# EAGLE design gedge (EAGLE 6.5.0)
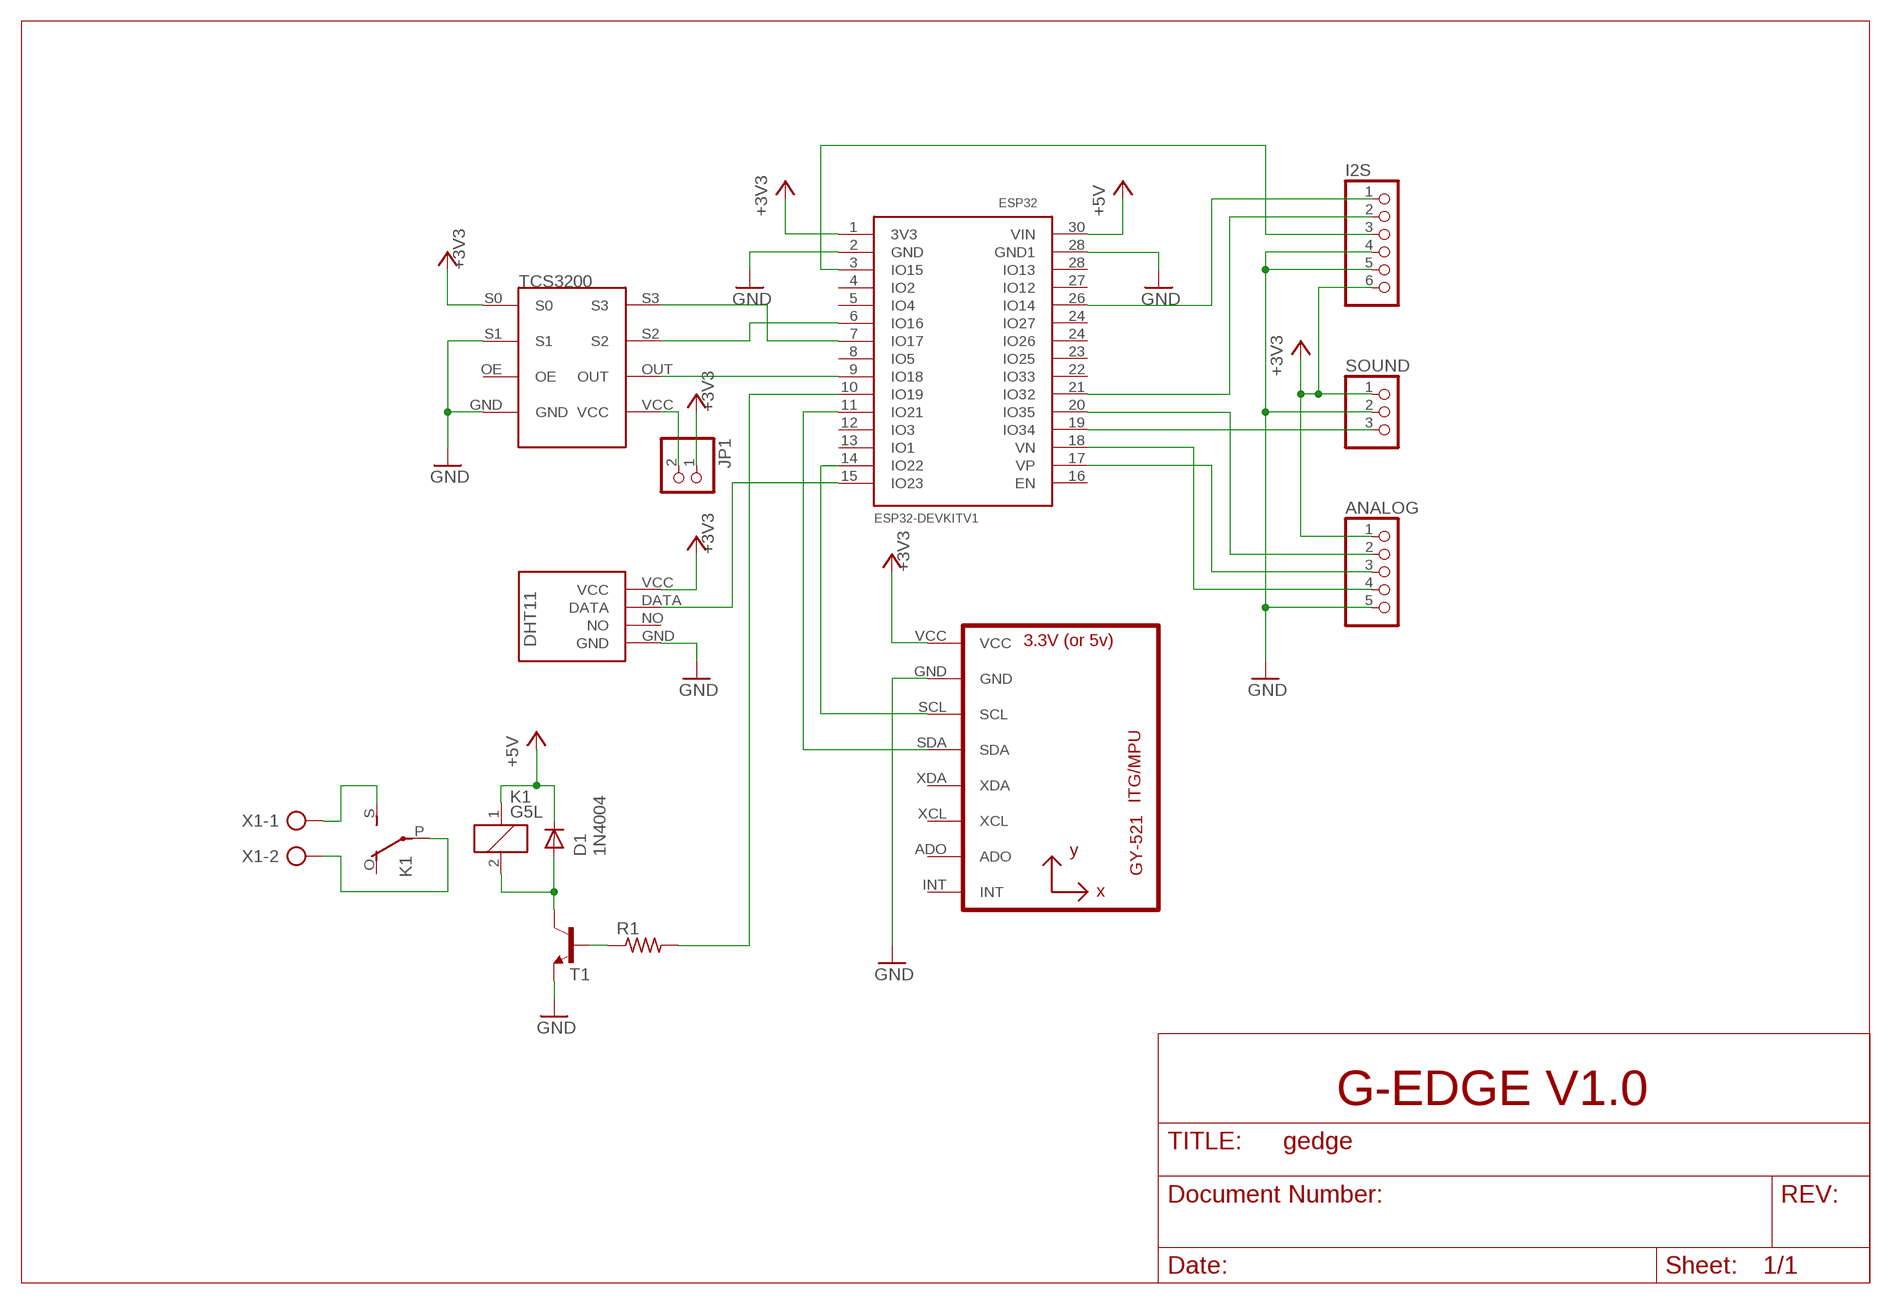
[diagram p0: schematic, sheet 1]

## Parts
ANALOG  PINHD-1X5  [1X05]
D1  1N4004  [DO41-10]
ESP32  ESP32DEVKITV1  [ESP32-DEVKITV1]
I2S  PINHD-1X6  [1X06]
JP1  PINHD-1X2  [1X02]
K1  G5L  [G5LE]
R1  R-US_0204/7  [0204/7]
SOUND  PINHD-1X3  [1X03]
T1  BC107A-NPN-TO18-EBC  [TO18]
TCS3200  TCS3200  [TCS3200]
U1  GY-521MPU6050  [GY-521]
U$2  DHT11  [DHT11]
X1  AK500/2  [AK500/2]

## Nets
+3V3: ANALOG.1 ESP32.1(3V3) I2S.6 JP1.1 SOUND.1 TCS3200.S0 U1.VCC U$2.VCC
+5V: D1.C ESP32.30(VIN) K1.1
GND: ANALOG.5 ESP32.2(GND) ESP32.28(GND1) I2S.4 I2S.5 SOUND.2 T1.1(E) TCS3200.GND TCS3200.S1 U1.GND U$2.GND
N$1: ESP32.6(IO16) TCS3200.S2
N$2: ESP32.7(IO17) TCS3200.S3
N$3: ESP32.19(IO34) SOUND.3
N$4: JP1.2 TCS3200.VCC
N$5: ESP32.9(IO18) TCS3200.OUT
N$6: ESP32.15(IO23) U$2.DATA
N$8: D1.A K1.2 T1.3(C)
N$9: K1.P(2:P) X1.2
N$10: K1.S(2:S) X1.1
N$11: R1.1 T1.2(B)
N$12: ESP32.10(IO19) R1.2
N$13: ESP32.14(IO22) U1.SCL
N$14: ESP32.11(IO21) U1.SDA
N$15: ANALOG.2 ESP32.20(IO35)
N$16: ANALOG.3 ESP32.17(VP)
N$17: ANALOG.4 ESP32.18(VN)
N$18: ESP32.3(IO15) I2S.3
N$19: ESP32.21(IO32) I2S.2
N$20: ESP32.26(IO14) I2S.1
Unconnected: ESP32.4(IO2) ESP32.5(IO4) ESP32.8(IO5) ESP32.12(IO3) ESP32.13(IO1) ESP32.16(EN) ESP32.22(IO33) ESP32.23(IO25) ESP32.24(IO26) ESP32.24(IO27) ESP32.27(IO12) ESP32.28(IO13) K1.O(2:O) TCS3200.OE U1.ADO U1.INT U1.XCL U1.XDA U$2.NO

## Notes on the sheet
- G-EDGE V1.0

## Library data of the parts
ANALOG = pinhead01:PINHD-1X5: PIN HEADER
D1 = diode:1N4004: DIODE general purpose rectifier, 1 A
ESP32 = ESP32-DEVKITV1:ESP32DEVKITV1
I2S = pinhead01:PINHD-1X6: PIN HEADER
JP1 = pinhead01:PINHD-1X2: PIN HEADER
K1 = relay:G5L: RELAY 1 x switch, 10 A/120 V AC, 8 A/30 V ADC, Omron; OC_FARNELL: unknown; OC_NEWARK: unknown
R1 = rcl:R-US_: RESISTOR, American symbol
SOUND = pinhead01:PINHD-1X3: PIN HEADER
T1 = transistor:*-NPN-: NPN Transistror BF959 corrected 2008.03.06
TCS3200 = TCS3200:TCS3200
U1 = gy-521:GY-521
U$2 = DHT11:DHT11: DHT11 Czujnik temperatury i wilgotności
X1 = con-ptr500:AK500/2: CONNECTOR; OC_FARNELL: unknown; OC_NEWARK: unknown

## Board
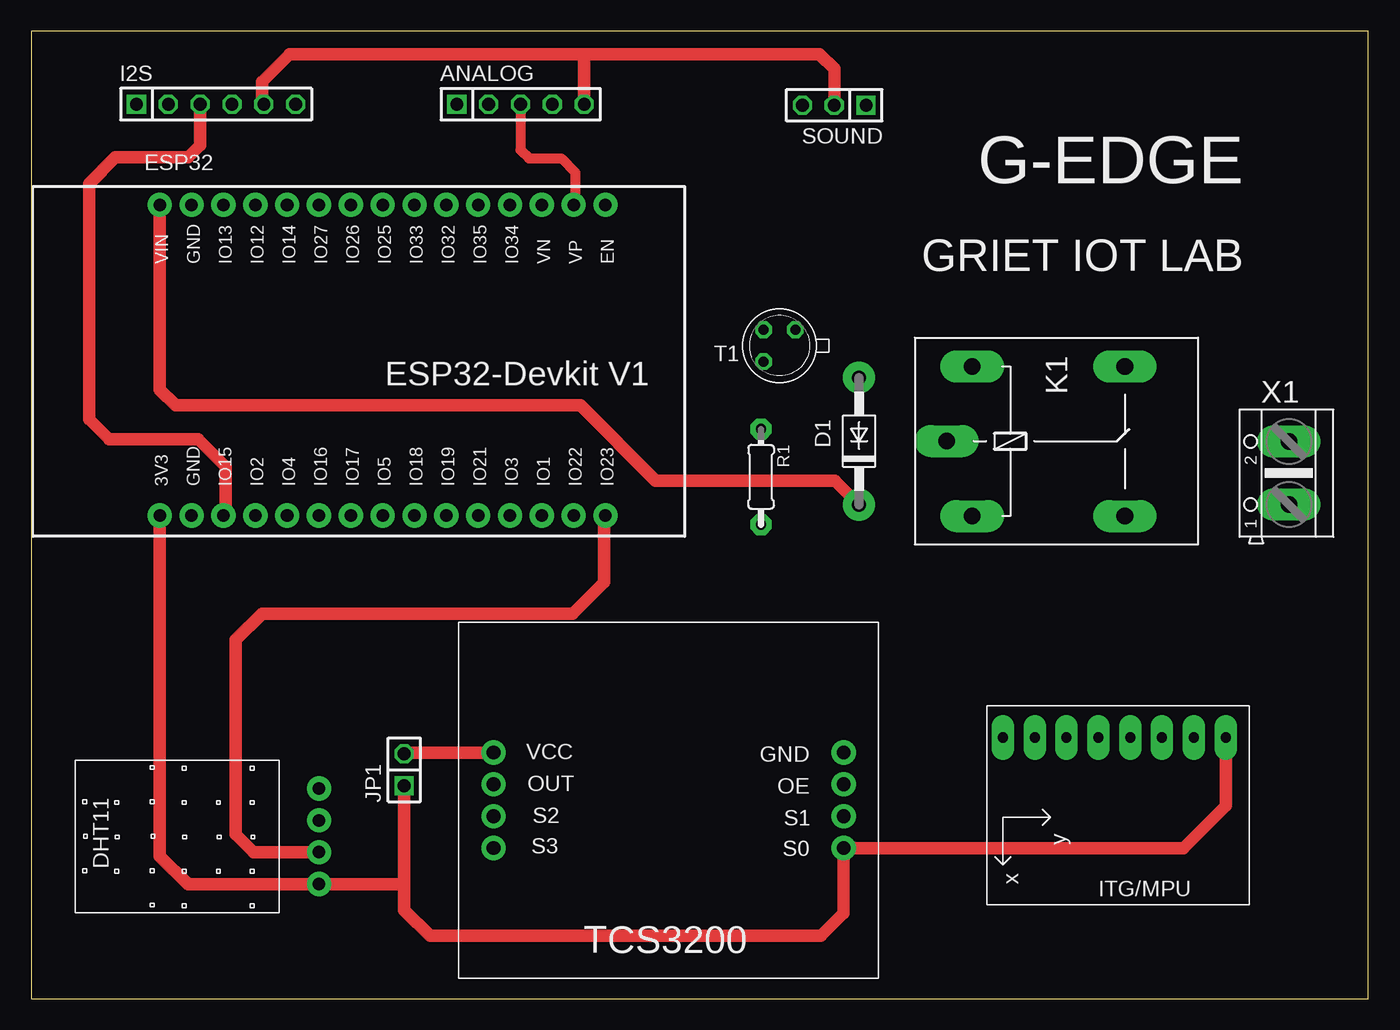
[diagram p1: board, top side]
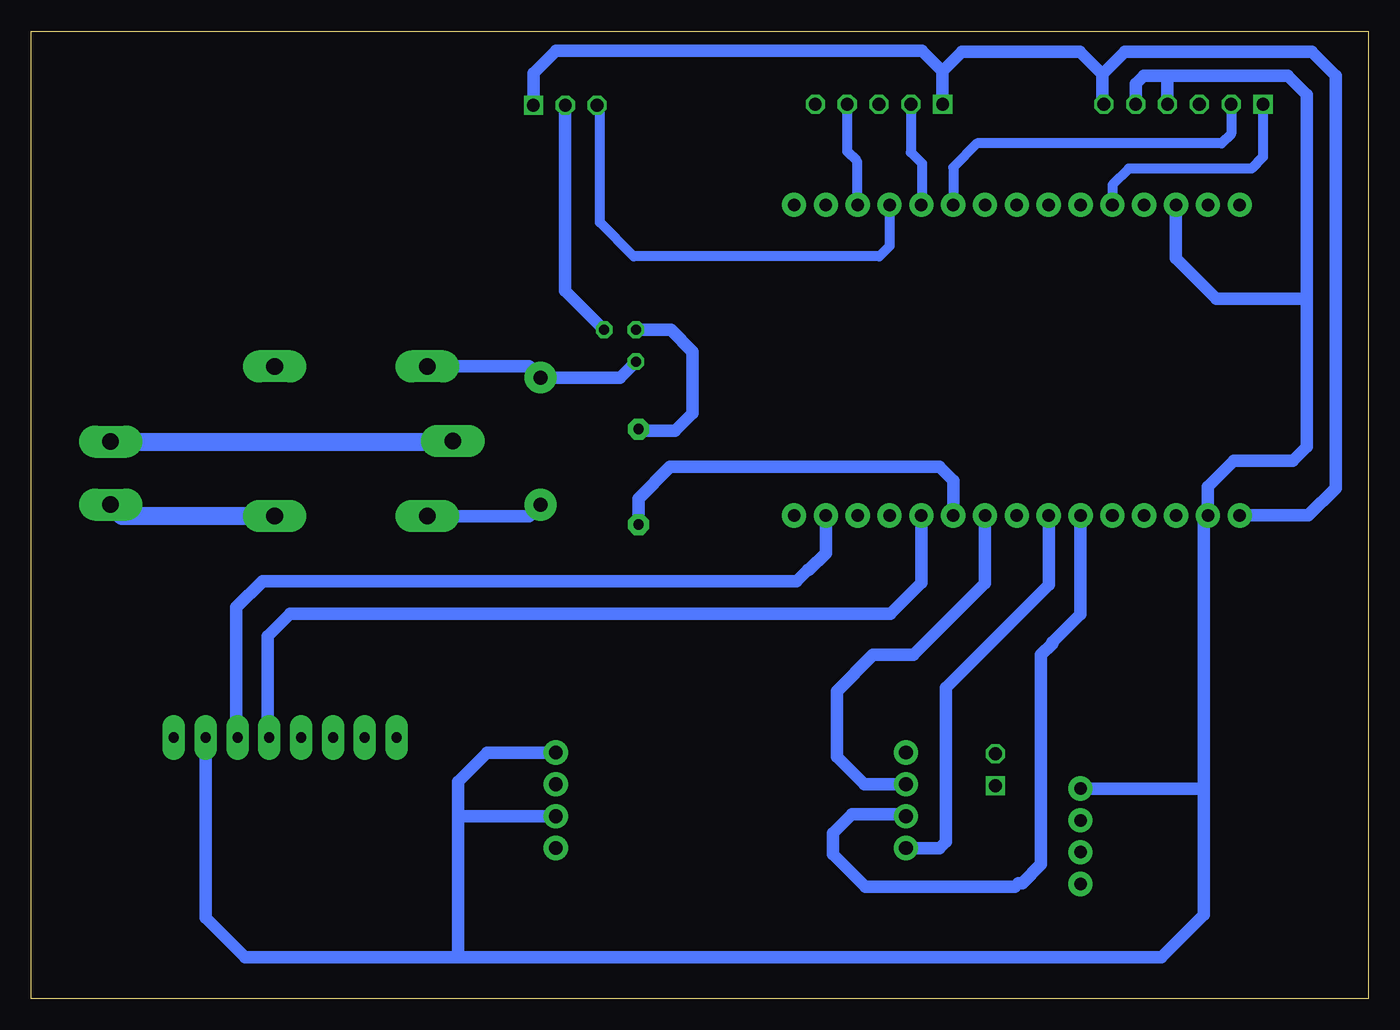
[diagram p2: board, bottom side, seen from below]

Size 106.66 x 77.14 mm. Coordinates in mm from the lower left corner, seen from the top.
Outline: 0,0 106.66,0 106.66,77.14 0,77.14 0,0
Copper layers (1*16): Top 0.035mm / dielectric 1.5mm / Bottom 0.035mm
Design rules "default": minimum track width 10mil, minimum drill 24mil, track to track 8mil, track to pad 8mil, pad to pad 8mil, via to via 8mil, smd to smd 8mil, copper to edge 40mil, drill to drill 8mil, minimum pad ring 10mil, minimum via ring 8mil, stop-mask expansion 4mil, vias tented up to drill 0mil, thermal gap 10mil

### Footprints (pad centres in the part's own frame; a part is rotated, then mirrored left to right if it is on the bottom)
1X05 = drill 1.016 square: 1 -5.08,0 | drill 1.016 octagon: 2 -2.54,0; 3 0,0; 4 2.54,0; 5 5.08,0
DO41-10 = drill 1.118 pad 2.54: A 5.08,0; C -5.08,0
ESP32-DEVKITV1 = drill 1 pad 1.93: 1 -22.87,-13.54; 2 -20.33,-13.54; 3 -17.79,-13.54; 4 -15.25,-13.54; 5 -12.71,-13.54; 6 -10.17,-13.54; 7 -7.63,-13.54; 8 -5.09,-13.54; 9 -2.55,-13.54; 10 -0.01,-13.54; 11 2.53,-13.54; 12 5.07,-13.54; 13 7.61,-13.54; 14 10.15,-13.54; 15 12.69,-13.54; 16 12.69,11.23; 17 10.15,11.23; 18 7.61,11.23; 19 5.07,11.23; 20 2.53,11.23; 21 -0.01,11.23; 22 -2.55,11.23; 23 -5.09,11.23; 24 -7.63,11.23; 25 -10.17,11.23; 26 -12.71,11.23; 27 -15.25,11.23; 28 -17.79,11.23; 29 -20.33,11.23; 30 -22.87,11.23
1X06 = drill 1.016 square: 1 -6.35,0 | drill 1.016 octagon: 2 -3.81,0; 3 -1.27,0; 4 1.27,0; 5 3.81,0; 6 6.35,0
1X02 = drill 1.016 square: 1 -1.27,0 | drill 1.016 octagon: 2 1.27,0
G5LE = drill 1.321 pad 2.54 long: 1 -7.493,-5.969; 2 -7.493,5.969; O 4.699,5.969; P -9.525,0; S 4.699,-5.969
0204/7 = drill 0.813 pad 1.676 octagon: 1 -3.81,0; 2 3.81,0
1X03 = drill 1.016 square: 1 -2.54,0 | drill 1.016 octagon: 2 0,0; 3 2.54,0
TO18 = drill 0.813 octagon: 1 -1.27,-1.27; 2 1.27,-1.27; 3 1.27,1.27
TCS3200 = drill 1.1 pad 1.93: GND -13.97,-3.81; OE -13.97,-1.27; OUT 13.97,-1.27; S0 -13.97,3.81; S1 -13.97,1.27; S2 13.97,1.27; S3 13.97,3.81; VCC 13.97,-3.81
GY-521 = drill 0.8 pad 1.778 long: ADO -8.89,-6.35; GND -8.89,6.35; INT -8.89,-8.89; SCL -8.89,3.81; SDA -8.89,1.27; VCC -8.89,8.89; XCL -8.89,-3.81; XDA -8.89,-1.27
DHT11 = drill 1 pad 1.93: DATA -1.27,-11.43; GND 3.81,-11.43; NO 1.27,-11.43; VCC -3.81,-11.43
AK500/2 = drill 1.321 pad 2.54 long: 1 -2.515,0; 2 2.515,0

### Placement (x,y rotation side)
ANALOG  39.03,71.32 0 top
D1  66.04,44.45 90 top
ESP32  33.12,52.07 0 top
I2S  14.74,71.32 0 top
JP1  29.75,18.25 90 top
K1  82.55,44.45 0 top
R1  58.22,41.61 270 top
SOUND  64.06,71.25 180 top
T1  59.69,52.07 180 top
TCS3200  50.84,15.81 180 top
U1  86.4,11.93 270 top
U$2  11.53,12.94 90 top
X1  100.33,41.91 90 top

### Tracks (layer width: path | path; a pad name or v marks a point on that pad's centre or on a via)
+3V3
  Top 1.016: U1.VCC 95.29,15.39 91.9,12 TCS3200.S0 64.8,6.8 63,5 31.8,5 29.75,7.05 29.75,8.9 | JP1.1 29.75,8.9 | 29.75,8.9 29.52,9.13 U$2.VCC 22.93,9.1 12.5,9.1 10.25,11.35 ESP32.1
  Bottom 1.016: ESP32.1 4.77,38.53 2.6,40.7 2.6,73.6 4.5,75.5 19.4,75.5 21.2,73.7 | 21.2,73.7 21.2,71.43 I2S.6 | ANALOG.1 33.95,73.95 | 33.95,73.95 32.4,75.5 23,75.5 21.2,73.7 | SOUND.1 66.6,73.8 64.8,75.6 35.6,75.6 33.95,73.95
+5V
  Top 1.016: ESP32.30 10.25,48.55 11.5,47.3 43.8,47.3 49.8,41.3 64.11,41.3 D1.C
  Bottom 1.016: K1.1 66.93,38.48 D1.C
GND
  Top 1.016: SOUND.2 64.06,74.14 62.9,75.3 43.9,75.3 | 43.9,75.3 20.6,75.3 18.4,73.1 18.4,71.47 I2S.5 | ANALOG.5 44.11,75.09 43.9,75.3
  Bottom 1.016: 4.9,55.6 4.9,44 6,42.9 10.7,42.9 12.79,40.81 ESP32.2 13.1,38.22 13.1,17 | 4.9,55.6 4.9,72.1 6.4,73.6 15.9,73.6 16.01,73.49 | I2S.4 16.01,73.49 | ESP32.28 15.33,59.03 12.1,55.8 5.1,55.8 4.9,55.6 | SOUND.2 64.06,56.44 T1.1 | U1.GND 92.75,6.45 89.6,3.3 72.5,3.3 | 72.5,3.3 16.5,3.3 13.1,6.7 13.1,17 | U$2.GND 13.35,16.75 13.1,17 | TCS3200.GND 70.28,19.62 72.6,17.3 72.6,14.2 | 72.6,14.2 72.6,3.4 72.5,3.3 | TCS3200.S1 72.26,14.54 72.6,14.2 | I2S.5 18.55,72.95 17.9,73.6 16.12,73.6 16.01,73.49
N$1
  Bottom 1.016: ESP32.6 22.95,30.65 25.2,28.4 25.2,28.3 26.1,27.4 26.1,10.7 27.6,9.2 27.9,9.2 28.2,8.9 40.1,8.9 42.7,11.5 42.7,13.2 41.2,14.7 37.03,14.7 TCS3200.S2
N$2
  Bottom 1.016: ESP32.7 25.49,33.01 33.7,24.8 33.7,12.5 34.2,12 TCS3200.S3
N$3
  Bottom 0.813: ESP32.19 38.19,60.01 39,59.2 58.6,59.2 61.3,61.9 61.3,71.03 SOUND.3
N$4
  Top 1.016: TCS3200.VCC 29.85,19.62 JP1.2
N$5
  Bottom 1.016: ESP32.9 30.57,33.13 36.3,27.4 39.5,27.4 42.4,24.5 42.4,19.3 40.2,17.1 36.89,17.1 TCS3200.OUT
N$6
  Top 1.016: U$2.DATA 17.73,11.67 16.3,13.1 16.3,28.6 18.4,30.7 43.2,30.7 45.7,33.2 45.7,38.42 ESP32.15
N$8
  Bottom 1.016: T1.3 59.69,49.53 D1.A 66.93,50.42 K1.2
N$9
  Bottom 1.422: X1.2 73.05,44.42 K1.P
N$10
  Bottom 1.422: K1.S 99.42,38.48 X1.1
N$11
  Bottom 1.016: T1.2 55.64,53.34 53.9,51.6 53.9,46.7 55.3,45.3 58.1,45.3 R1.1
N$12
  Bottom 1.016: R1.2 58.22,39.88 55.7,42.4 34.2,42.4 33.1,41.3 ESP32.10
N$13
  Bottom 1.016: ESP32.14 43.27,35.53 44.6,34.2 44.7,34.2 45.6,33.3 88.2,33.3 90.3,31.2 90.3,20.91 U1.SCL
N$14
  Bottom 1.016: ESP32.11 35.65,33.15 38.1,30.7 86,30.7 87.8,28.9 87.8,20.95 U1.SDA
N$15
  Bottom 0.813: ANALOG.2 36.49,67.49 35.6,66.6 35.6,63.35 ESP32.20
N$16
  Top 0.813: ANALOG.3 39.03,67.67 39.7,67 42.3,67 43.4,65.9 43.4,63.43 ESP32.17
N$17
  Bottom 0.813: ANALOG.4 41.57,67.57 40.8,66.8 40.8,63.37 ESP32.18
N$18
  Top 1.016: I2S.3 13.47,68.07 12.5,67.1 6.7,67.1 4.6,65 4.6,46.2 6.2,44.6 13.3,44.6 15.5,42.4 15.5,38.7 ESP32.3
N$19
  Bottom 0.813: I2S.2 10.93,68.97 11.7,68.2 31.2,68.2 33.1,66.3 ESP32.21
N$20
  Bottom 0.813: I2S.1 8.39,67.11 9.3,66.2 19.1,66.2 20.4,64.9 ESP32.26

### Text on the board
tNames: G-EDGE | GRIET IOT LAB